# EAGLE schematic Beamersteuerung (EAGLE 6.4)
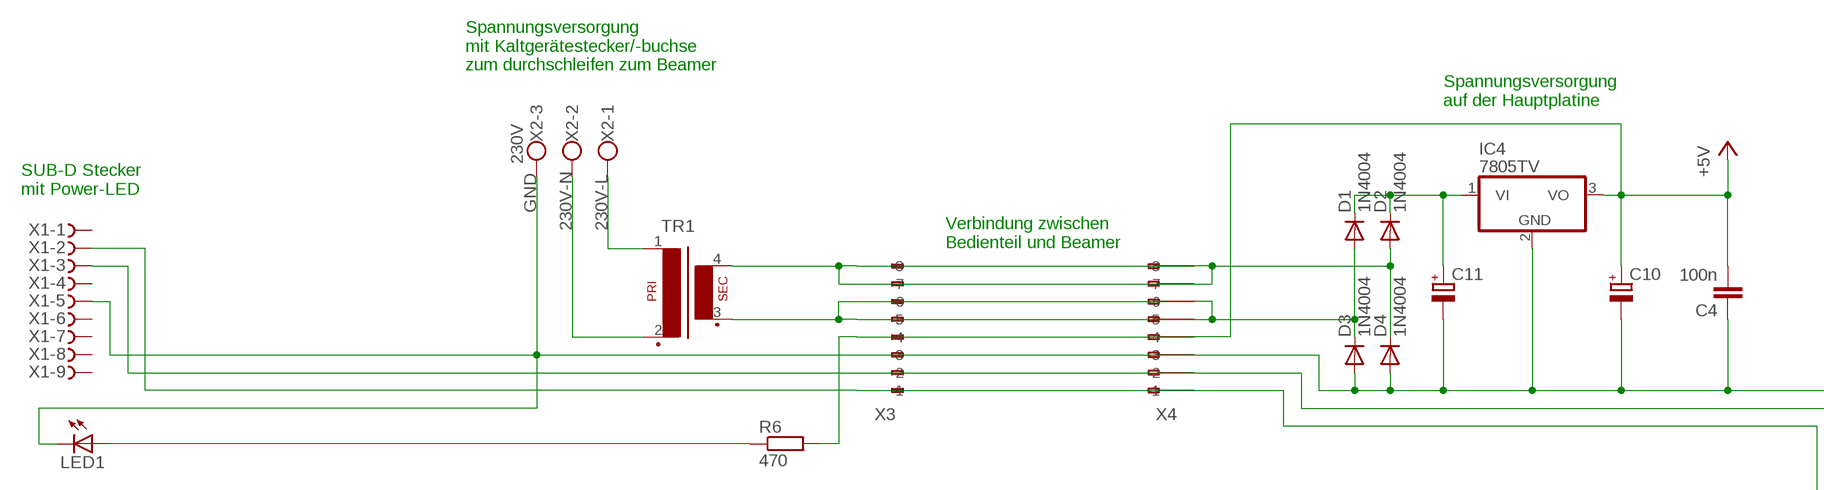
[diagram p0: schematic, sheet 1, part 1 of 2]
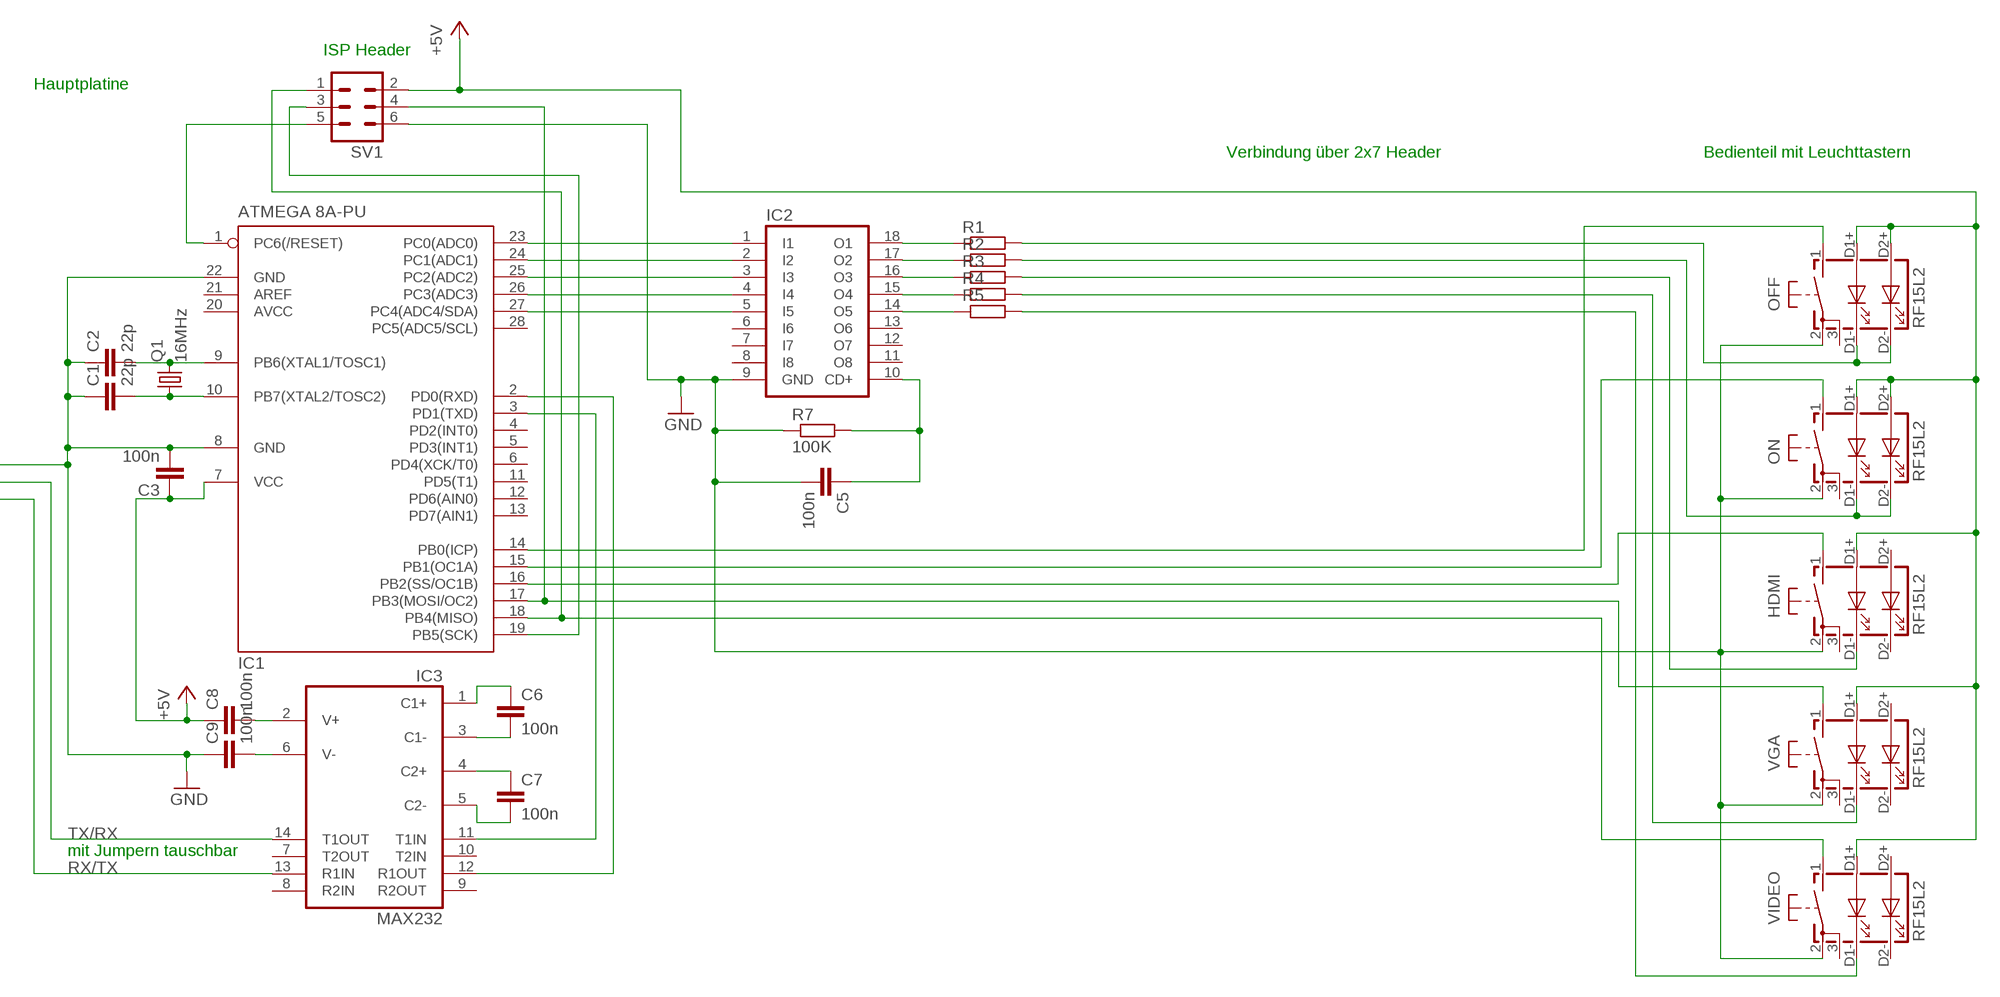
[diagram p1: schematic, sheet 1, part 2 of 2]

## Parts
C1  22p  C-EU025-024X044  [C025-024X044]
C2  22p  C-EU025-024X044  [C025-024X044]
C3  100n  C-EU025-024X044  [C025-024X044]
C4  100n  C-EU025-024X044  [C025-024X044]
C5  100n  C-EU025-024X044  [C025-024X044]
C6  100n  C-EU025-024X044  [C025-024X044]
C7  100n  C-EU025-024X044  [C025-024X044]
C8  100n  C-EU025-024X044  [C025-024X044]
C9  100n  C-EU025-024X044  [C025-024X044]
C10  CPOL-EUE2.5-6  [E2,5-6]
C11  CPOL-EUE2.5-6  [E2,5-6]
D1  1N4004  [DO41-10]
D2  1N4004  [DO41-10]
D3  1N4004  [DO41-10]
D4  1N4004  [DO41-10]
HDMI  RF15L2  [RF15L2]
IC1  ATMEGA 8A-PU  MEGA8-P  [DIL28-3]
IC2  ULN2803A  [DIL18]
IC3  MAX232  [DIL16]
IC4  7805TV  [TO220V]
LED1  LED3MM  [LED3MM]
OFF  RF15L2  [RF15L2]
ON  RF15L2  [RF15L2]
Q1  16MHz  CRYSTALHC49S  [HC49/S]
R1  R-EU_0207/12  [0207/12]
R2  R-EU_0207/12  [0207/12]
R3  R-EU_0207/12  [0207/12]
R4  R-EU_0207/12  [0207/12]
R5  R-EU_0207/12  [0207/12]
R6  470  R-EU_0207/12  [0207/12]
R7  100K  R-EU_0207/12  [0207/12]
SV1  ML6  [ML6]
TR1  VP31  [VP31]
VGA  RF15L2  [RF15L2]
VIDEO  RF15L2  [RF15L2]
X1  F09VS  [F09V]
X2  230V  W237-103  [W237-103]
X3  233-508  [233-508]
X4  233-508  [233-508]

## Nets
230V-L: TR1.1 X2.1
230V-N: TR1.2 X2.2
+5V: C3.1 C4.2 C8.1 C10.+ HDMI.D1+(A1) IC1.7(VCC) IC4.3(VO) OFF.D1+(A1) OFF.D2+(A2) ON.D1+(A1) ON.D2+(A2) R6.2 SV1.2 VGA.D1+(A1) VIDEO.D1+(A1) X3.A4(-4) X4.A4(-4)
GND: C1.1 C2.1 C3.2 C4.1 C5.2 C9.1 C10.- C11.- D3.A D4.A HDMI.2(P) IC1.8(GND) IC1.22(GND) IC2.9(GND) IC4.2(GND) LED1.K(C) OFF.2(P) ON.2(P) R7.1 SV1.6 VGA.2(P) VIDEO.2(P) X1.5 X2.3 X3.A3(-3) X4.A3(-3)
N$2: C6.1 IC3.1(C1+)
N$3: C6.2 IC3.3(C1-)
N$4: IC1.23(PC0(ADC0)) IC2.1(I1)
N$5: IC1.24(PC1(ADC1)) IC2.2(I2)
N$6: IC1.25(PC2(ADC2)) IC2.3(I3)
N$7: IC1.26(PC3(ADC3)) IC2.4(I4)
N$8: IC1.27(PC4(ADC4/SDA)) IC2.5(I5)
N$9: IC2.18(O1) R1.1
N$10: IC2.17(O2) R2.1
N$11: IC2.16(O3) R3.1
N$12: IC2.15(O4) R4.1
N$13: IC2.14(O5) R5.1
N$14: C7.1 IC3.4(C2+)
N$15: C7.2 IC3.5(C2-)
N$16: IC1.3(PD1(TXD)) IC3.11(T1IN)
N$17: OFF.D1-(C1) OFF.D2-(C2) R1.2
N$18: ON.D1-(C1) ON.D2-(C2) R2.2
N$19: HDMI.D1-(C1) R3.2
N$20: R4.2 VGA.D1-(C1)
N$21: R5.2 VIDEO.D1-(C1)
N$22: IC1.18(PB4(MISO)) SV1.1 VIDEO.1(S)
N$23: IC1.17(PB3(MOSI/OC2)) SV1.4 VGA.1(S)
N$24: HDMI.1(S) IC1.16(PB2(SS/OC1B))
N$25: IC1.15(PB1(OC1A)) ON.1(S)
N$26: IC1.14(PB0(ICP)) OFF.1(S)
N$27: IC1.1(PC6(/RESET)) SV1.5
N$28: IC1.2(PD0(RXD)) IC3.12(R1OUT)
N$29: IC1.19(PB5(SCK)) SV1.3
N$30: C5.1 IC2.10(CD+) R7.2
N$31: C8.2 IC3.2(V+)
N$32: C9.2 IC3.6(V-)
N$33: D2.A D4.C TR1.4(S4) X3.A7(-7) X3.A8(-8) X4.A7(-7) X4.A8(-8)
N$34: D1.A D3.C TR1.3(S3) X3.A5(-5) X3.A6(-6) X4.A5(-5) X4.A6(-6)
N$41: LED1.A R6.1
N$42: C2.2 IC1.9(PB6(XTAL1/TOSC1)) Q1.2
N$45: C1.2 IC1.10(PB7(XTAL2/TOSC2)) Q1.1
N$48: C11.+ D1.C D2.C IC4.1(VI)
RX/TX: IC3.13(R1IN) X1.2 X3.A1(-1) X4.A1(-1)
TX/RX: IC3.14(T1OUT) X1.3 X3.A2(-2) X4.A2(-2)
Unconnected: HDMI.3(P) HDMI.D2+(A2) HDMI.D2-(C2) IC1.4(PD2(INT0)) IC1.5(PD3(INT1)) IC1.6(PD4(XCK/T0)) IC1.11(PD5(T1)) IC1.12(PD6(AIN0)) IC1.13(PD7(AIN1)) IC1.21(AREF) IC1.28(PC5(ADC5/SCL)) IC2.6(I6) IC2.7(I7) IC2.8(I8) IC2.11(O8) IC2.12(O7) IC2.13(O6) IC3.7(T2OUT) IC3.8(R2IN) IC3.9(R2OUT) IC3.10(T2IN) OFF.3(P) ON.3(P) VGA.3(P) VGA.D2+(A2) VGA.D2-(C2) VIDEO.3(P) VIDEO.D2+(A2) VIDEO.D2-(C2) X1.1 X1.4 X1.6 X1.7 X1.8 X1.9 X3.B1(B-1) X3.B2(B-2) X3.B3(B-3) X3.B4(B-4) X3.B5(B-5) X3.B6(B-6) X3.B7(B-7) X3.B8(B-8) X4.B1(B-1) X4.B2(B-2) X4.B3(B-3) X4.B4(B-4) X4.B5(B-5) X4.B6(B-6) X4.B7(B-7) X4.B8(B-8)

## Notes on the sheet
- ISP Header
- Hauptplatine
- Spannungsversorgung
  mit Kaltgerätestecker/-buchse
  zum durchschleifen zum Beamer
- Verbindung über 2x7 Header | Bedienteil mit Leuchttastern
- Spannungsversorgung
  auf der Hauptplatine
- SUB-D Stecker
  mit Power-LED
- Verbindung zwischen
  Bedienteil und Beamer
- mit Jumpern tauschbar

## Power pins joined to a net without a drawn wire
AVCC: IC1.20(AVCC)
GND: IC3.15(GND)
VCC: IC3.16(VCC)

## Library data of the parts
C1-C9 = resistor:C-EU: CAPACITOR, European symbol
C10 C11 = resistor:CPOL-EU: POLARIZED CAPACITOR, European symbol
D1-D4 = diode:1N4004: DIODE general purpose rectifier, 1 A
HDMI OFF ON VGA VIDEO = switch-misc:RF15L2: RAFI SWITCH
IC1 = atmel:MEGA8-P: MICROCONTROLLER 8 Kbytes FLASH, 1 kbytes SRAM, 512 bytes EEPROM, USART, 4-channel 10 bit ADC, 2-channel 8 bit ADC Pin compatible with Atmega48, ATMega88, ATMega168 Source: avr.lbr; OC_FARNELL: unknown; OC_NEWARK: unknown
IC2 = uln-udn:ULN2803A: DRIVER ARRAY
IC3 = maxim:MAX232: RS232 TRANSEIVER; MF: MAXIM; MPN: MAX232ACPE+; OC_FARNELL: 9723773; OC_NEWARK: 68K4544
IC4 = linear:78*: Positive VOLTAGE REGULATOR Source: http://cache.national.com/ds/LM/LM78L05.pdf http://www.fairchildsemi.com/ds/LM/LM7805.pdf
LED1 = led:LED: LED OSRAM: - CHIPLED LG R971, LG N971, LY N971, LG Q971, LY Q971, LO R971, LY R971 LH N974, LH R974 LS Q976, LO Q976, LY Q976 LO Q996 - Hyper CHIPLED LW Q18S LB Q993, LB Q99A, LB R99A - SideLED LS A670, LO A670, LY A670, LG A670, LP A670 LB A673, LV A673, LT A673, LW A673 LH A674 LY A675 LS A676, LA A676, LO A676, LY A676, LW A676 LS A679, LY A679, LG A679 - Hyper Micro SIDELED® LS Y876, LA Y876, LO Y876, LY Y876 LT Y87S - SmartLED LW L88C, LW L88S LB L89C, LB L89S, LG L890 LS L89K, LO L89K, LY L89K LS L896, LA L896, LO L896, LY L896 - TOPLED LS T670, LO T670, LY T670, LG T670, LP T670 LSG T670, LSP T670, LSY T670, LOP T670, LYG T670 LG T671, LOG T671, LSG T671 LB T673, LV T673, LT T673, LW T673 LH T674 LS T676, LA T676, LO T676, LY T676, LB T676, LH T676, LSB T676, LW T676 LB T67C, LV T67C, LT T67C, LS T67K, LO T67K, LY T67K, LW E67C LS E67B, LA E67B, LO E67B, LY E67B, LB E67C, LV E67C, LT E67C LW T67C LS T679, LY T679, LG T679 LS T770, LO T770, LY T770, LG T770, LP T770 LB T773, LV T773, LT T773, LW T773 LH T774 LS E675, LA E675, LY E675, LS T675 LS T776, LA T776, LO T776, LY T776, LB T776 LHGB T686 LT T68C, LB T68C - Hyper Mini TOPLED® LB M676 - Mini TOPLED Santana® LG M470 LS M47K, LO M47K, LY M47K Source: http://www.osram.convergy.de LUXEON: - LUMILED® LXK2-PW12-R00, LXK2-PW12-S00, LXK2-PW14-U00, LXK2-PW14-V00 LXK2-PM12-R00, LXK2-PM12-S00, LXK2-PM14-U00 LXK2-PE12-Q00, LXK2-PE12-R00, LXK2-PE12-S00, LXK2-PE14-T00, LXK2-PE14-U00 LXK2-PB12-K00, LXK2-PB12-L00, LXK2-PB12-M00, LXK2-PB14-N00, LXK2-PB14-P00, LXK2-PB14-Q00 LXK2-PR12-L00, LXK2-PR12-M00, LXK2-PR14-Q00, LXK2-PR14-R00 LXK2-PD12-Q00, LXK2-PD12-R00, LXK2-PD12-S00 LXK2-PH12-R00, LXK2-PH12-S00 LXK2-PL12-P00, LXK2-PL12-Q00, LXK2-PL12-R00 Source: www.luxeon.com KINGBRIGHT: KA-3528ASYC Source: www.kingbright.com
Q1 = crystal:CRYSTAL: CRYSTAL; OC_FARNELL: 1667008; OC_NEWARK: unknown
R1-R7 = resistor:R-EU_: RESISTOR, European symbol
SV1 = con-ml:ML6: HARTING; OC_FARNELL: unknown; OC_NEWARK: unknown
TR1 = trafo:VP31: TRANSFORMER 1 primary winding, 1 secondary winding BLOCK
X1 = con-subd:F09?S: SUB-D; OC_FARNELL: unknown; OC_NEWARK: unknown
X2 = con-wago-500:W237-103: WAGO SCREW CLAMP; MPN: 237-103; OC_FARNELL: unknown; OC_NEWARK: 18M7116
X3 X4 = con-wago255:233-508: WAGO; MF: Wago Corporation; MPN: 0233-0508; OC_FARNELL: 1777101; OC_NEWARK: 79K2053